# EAGLE design LED (EAGLE 6.2)
AUTHER: Karsten Hinz
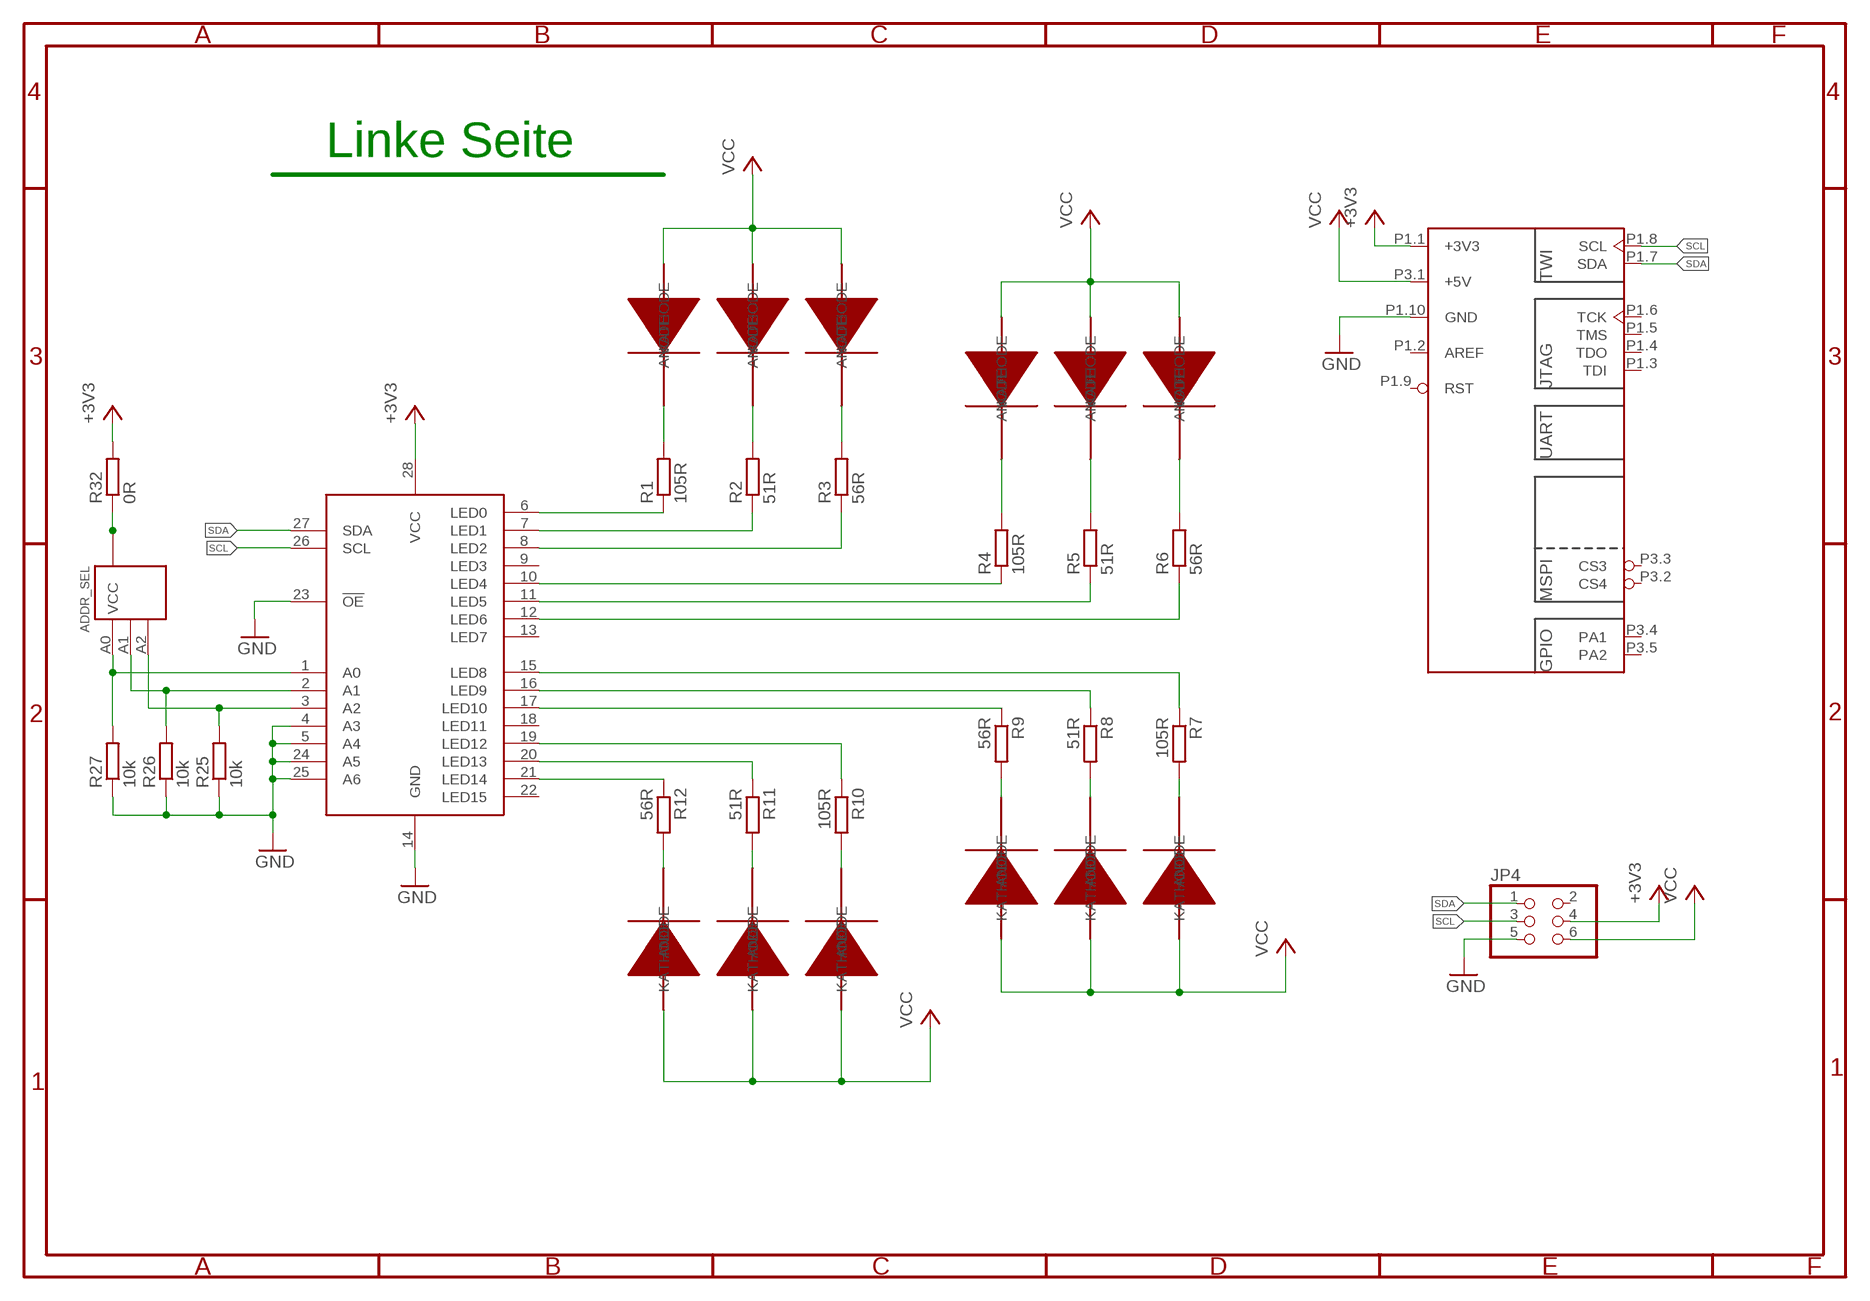
[diagram p0: schematic, sheet 1, part 1 of 2]
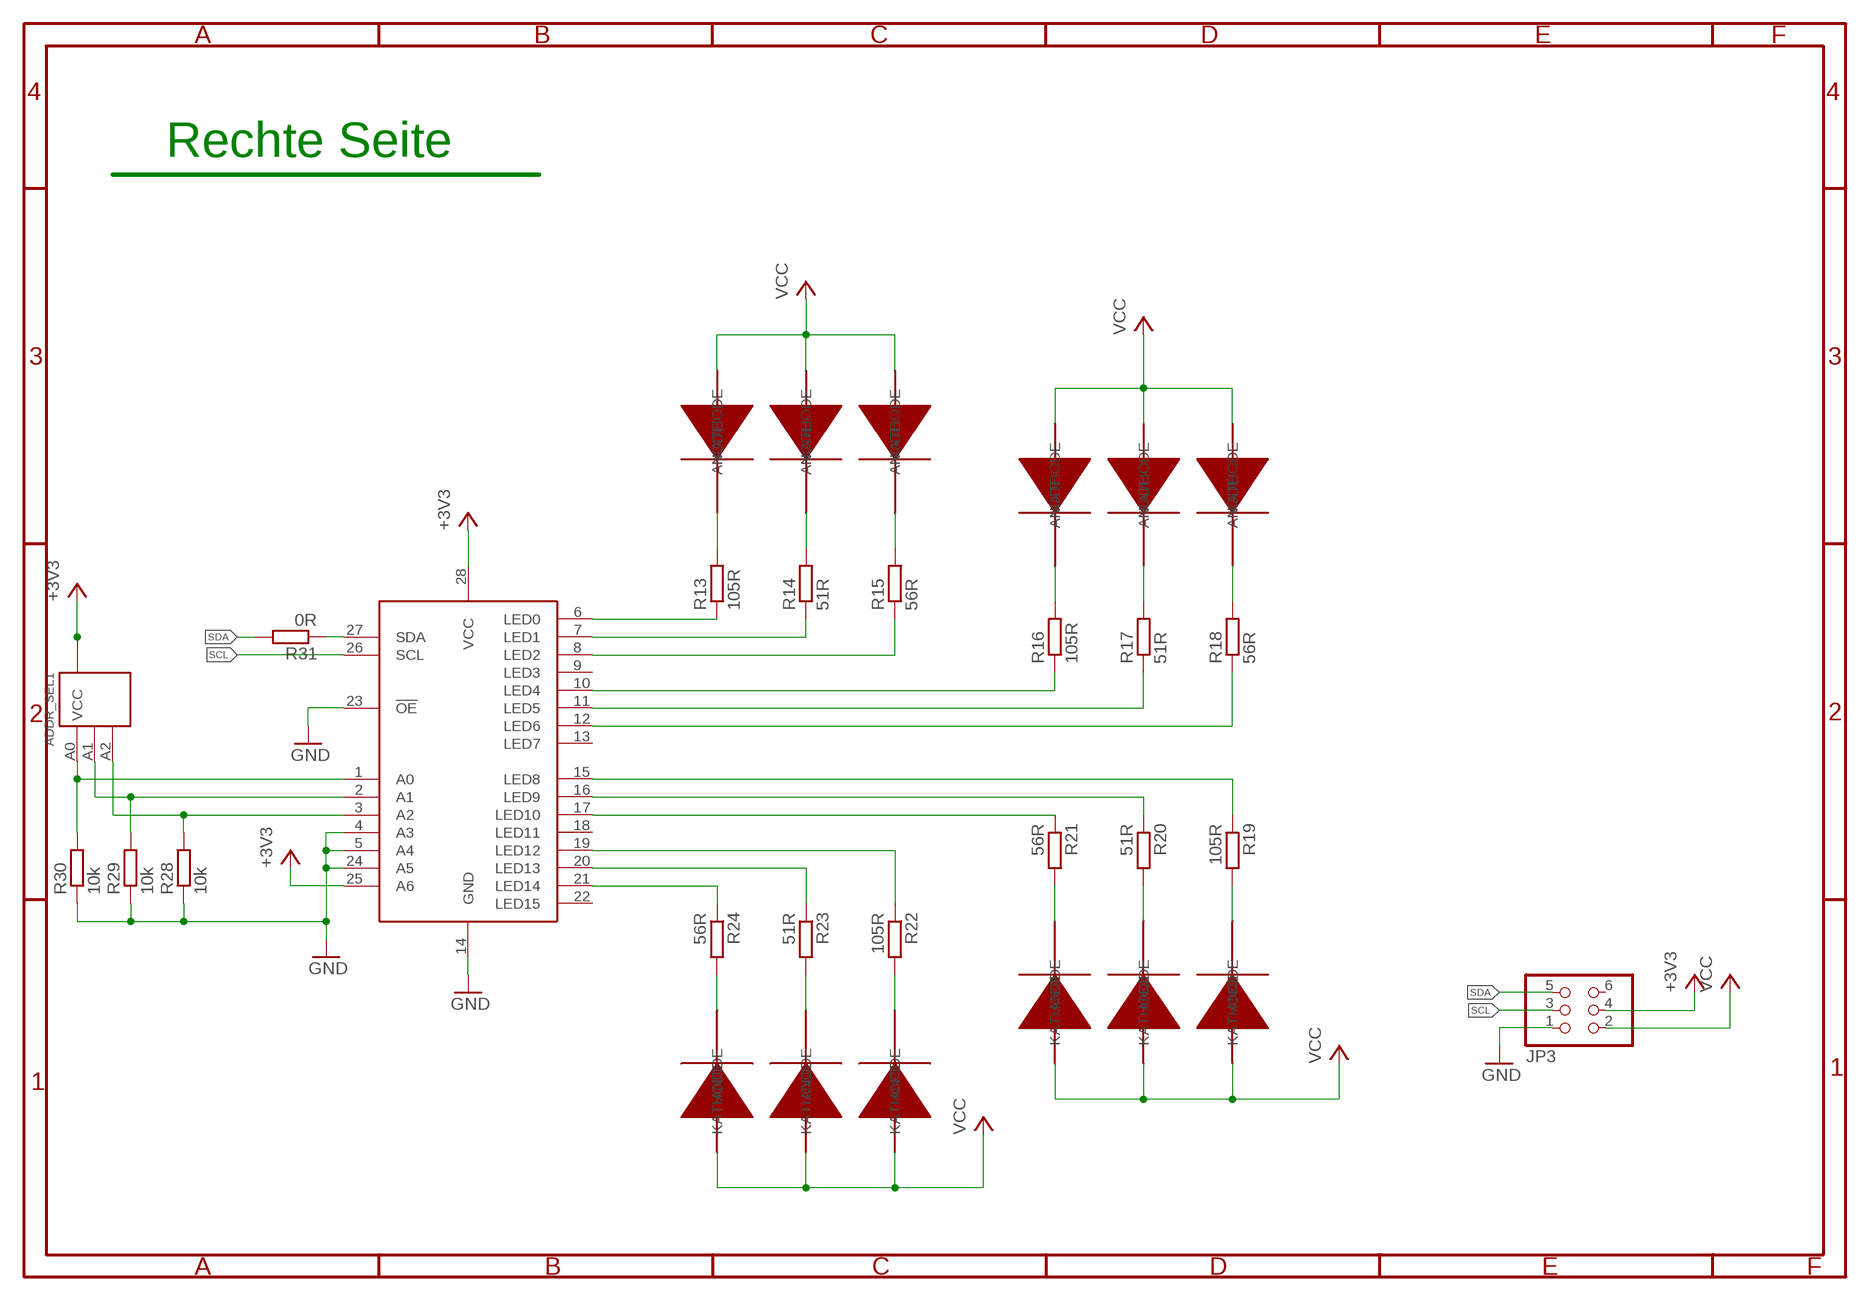
[diagram p1: schematic, sheet 1, part 2 of 2]

## Parts
ADDR_SEL  ADDR_SEL  [ADDR_SEL]
ADDR_SEL1  ADDR_SEL  [ADDR_SEL]
JP3  PINHD-2X3_2.54-90°  [2X03/90]
JP4  PINHD-2X3_2.54-90°  [2X03/90]
R1  105R  R-EU_R0603  [R0603]
R2  51R  R-EU_R0603  [R0603]
R3  56R  R-EU_R0603  [R0603]
R4  105R  R-EU_R0603  [R0603]
R5  51R  R-EU_R0603  [R0603]
R6  56R  R-EU_R0603  [R0603]
R7  105R  R-EU_R0603  [R0603]
R8  51R  R-EU_R0603  [R0603]
R9  56R  R-EU_R0603  [R0603]
R10  105R  R-EU_R0603  [R0603]
R11  51R  R-EU_R0603  [R0603]
R12  56R  R-EU_R0603  [R0603]
R13  105R  R-EU_R0603  [R0603]
R14  51R  R-EU_R0603  [R0603]
R15  56R  R-EU_R0603  [R0603]
R16  105R  R-EU_R0603  [R0603]
R17  51R  R-EU_R0603  [R0603]
R18  56R  R-EU_R0603  [R0603]
R19  105R  R-EU_R0603  [R0603]
R20  51R  R-EU_R0603  [R0603]
R21  56R  R-EU_R0603  [R0603]
R22  105R  R-EU_R0603  [R0603]
R23  51R  R-EU_R0603  [R0603]
R24  56R  R-EU_R0603  [R0603]
R25  10k  R-EU_R0402  [R0402]
R26  10k  R-EU_R0603  [R0603]
R27  10k  R-EU_R0402  [R0402]
R28  10k  R-EU_R0603  [R0603]
R29  10k  R-EU_R0603  [R0603]
R30  10k  R-EU_R0603  [R0603]
R31  0R  R-EU_R0603  [R0603]
R32  0R  R-EU_R0603  [R0603]
U$1  RGB-LED  [PLCC_SMD_LED_RGB]
U$2  RGB-LED  [PLCC_SMD_LED_RGB]
U$3  RGB-LED  [PLCC_SMD_LED_RGB]
U$4  RGB-LED  [PLCC_SMD_LED_RGB]
U$6  INGA_OHNE_JP2  [INGA_JP1_JP3]
U$9  PCA9635  [TSSOP28]
U$11  RGB-LED  [PLCC_SMD_LED_RGB]
U$12  RGB-LED  [PLCC_SMD_LED_RGB]
U$13  RGB-LED  [PLCC_SMD_LED_RGB]
U$14  RGB-LED  [PLCC_SMD_LED_RGB]
U$15  PCA9635  [TSSOP28]

## Nets
+3V3: JP3.4 JP4.4 R32.2 U$6.P1.1(+3V3) U$9.28(VCC) U$15.28(VCC)
BLA: ADDR_SEL.VCC ADDR_SEL.VCC@1(VCC) ADDR_SEL.VCC@2(VCC) R32.1
GND: JP3.1 JP4.5 R25.1 R26.1 R27.1 R28.1 R29.1 R30.1 U$6.P1.10(GND) U$9.4(A3) U$9.5(A4) U$9.14(GND) U$9.23(!OE) U$9.24(A5) U$9.25(A6) U$15.4(A3) U$15.5(A4) U$15.14(GND) U$15.23(!OE) U$15.24(A5)
N$1: R1.1 U$9.6(LED0)
N$2: R2.1 U$9.7(LED1)
N$3: R3.1 U$9.8(LED2)
N$4: R4.1 U$9.10(LED4)
N$5: R5.1 U$9.11(LED5)
N$6: R6.1 U$9.12(LED6)
N$7: R7.1 U$9.15(LED8)
N$8: R8.1 U$9.16(LED9)
N$9: R9.1 U$9.17(LED10)
N$10: R10.1 U$9.19(LED12)
N$11: R11.1 U$9.20(LED13)
N$12: R12.1 U$9.21(LED14)
N$13: R12.2 U$4.P1(BLUE:KATHODE)
N$14: R11.2 U$4.P2(GREEN:KATHODE)
N$15: R10.2 U$4.P3(RED:KATHODE)
N$17: R7.2 U$3.P3(RED:KATHODE)
N$18: R8.2 U$3.P2(GREEN:KATHODE)
N$19: R2.2 U$1.P2(GREEN:KATHODE)
N$20: R1.2 U$1.P3(RED:KATHODE)
N$21: R3.2 U$1.P1(BLUE:KATHODE)
N$22: R4.2 U$2.P3(RED:KATHODE)
N$23: R5.2 U$2.P2(GREEN:KATHODE)
N$24: R6.2 U$2.P1(BLUE:KATHODE)
N$25: R13.2 U$11.P3(RED:KATHODE)
N$26: R13.1 U$15.6(LED0)
N$27: R14.1 U$15.7(LED1)
N$28: R15.1 U$15.8(LED2)
N$29: R16.1 U$15.10(LED4)
N$30: R17.1 U$15.11(LED5)
N$31: R18.1 U$15.12(LED6)
N$32: R19.1 U$15.15(LED8)
N$33: R20.1 U$15.16(LED9)
N$34: R21.1 U$15.17(LED10)
N$35: R22.1 U$15.19(LED12)
N$36: R23.1 U$15.20(LED13)
N$37: R24.1 U$15.21(LED14)
N$38: R14.2 U$11.P2(GREEN:KATHODE)
N$39: R15.2 U$11.P1(BLUE:KATHODE)
N$40: R16.2 U$12.P3(RED:KATHODE)
N$41: R17.2 U$12.P2(GREEN:KATHODE)
N$42: R18.2 U$12.P1(BLUE:KATHODE)
N$43: R24.2 U$14.P1(BLUE:KATHODE)
N$44: R23.2 U$14.P2(GREEN:KATHODE)
N$45: R22.2 U$14.P3(RED:KATHODE)
N$46: R21.2 U$13.P1(BLUE:KATHODE)
N$47: R20.2 U$13.P2(GREEN:KATHODE)
N$48: R19.2 U$13.P3(RED:KATHODE)
N$49: R9.2 U$3.P1(BLUE:KATHODE)
N$51: ADDR_SEL.A2 R25.2 U$9.3(A2)
N$52: ADDR_SEL.A1 R26.2 U$9.2(A1)
N$53: ADDR_SEL.A0 R27.2 U$9.1(A0)
N$54: ADDR_SEL1.A2 R28.2 U$15.3(A2)
N$55: ADDR_SEL1.A1 R29.2 U$15.2(A1)
N$56: ADDR_SEL1.A0 R30.2 U$15.1(A0)
SCL: JP3.3 JP4.3 U$6.P1.8(SCL) U$9.26(SCL) U$15.26(SCL)
SDA: JP3.5 JP4.1 R31.2 U$6.P1.7(SDA) U$9.27(SDA)
SDA@1: R31.1 U$15.27(SDA)
VCC: ADDR_SEL1.VCC ADDR_SEL1.VCC@1(VCC) ADDR_SEL1.VCC@2(VCC) JP3.2 JP4.6 U$1.P4(RED:ANODE) U$1.P5(GREEN:ANODE) U$1.P6(BLUE:ANODE) U$2.P4(RED:ANODE) U$2.P5(GREEN:ANODE) U$2.P6(BLUE:ANODE) U$3.P4(RED:ANODE) U$3.P5(GREEN:ANODE) U$3.P6(BLUE:ANODE) U$4.P4(RED:ANODE) U$4.P5(GREEN:ANODE) U$4.P6(BLUE:ANODE) U$6.P3.1(+5V) U$11.P4(RED:ANODE) U$11.P5(GREEN:ANODE) U$11.P6(BLUE:ANODE) U$12.P4(RED:ANODE) U$12.P5(GREEN:ANODE) U$12.P6(BLUE:ANODE) U$13.P4(RED:ANODE) U$13.P5(GREEN:ANODE) U$13.P6(BLUE:ANODE) U$14.P4(RED:ANODE) U$14.P5(GREEN:ANODE) U$14.P6(BLUE:ANODE) U$15.25(A6) ; supply symbol labelled +3V3
Unconnected: JP3.6 JP4.2 U$6.P1.2(AREF) U$6.P1.3(TDI) U$6.P1.4(TDO) U$6.P1.5(TMS) U$6.P1.6(TCK) U$6.P1.9(RST) U$6.P3.2(CS4) U$6.P3.3(CS3) U$6.P3.4(PA1) U$6.P3.5(PA2) U$9.9(LED3) U$9.13(LED7) U$9.18(LED11) U$9.22(LED15) U$15.9(LED3) U$15.13(LED7) U$15.18(LED11) U$15.22(LED15)

## Notes on the sheet
- Linke Seite | Rechte Seite

## Library data of the parts
ADDR_SEL ADDR_SEL1 = inga:ADDR_SEL
JP3 JP4 = pinhead-1:PINHD-2X3: PIN HEADER
R1-R32 = rcl:R-EU_: RESISTOR, European symbol
U$1-U$4 U$11-U$14 = RGB-LED:RGB-LED: Descriptions: Impolux PLCC SMD LEDs offer high?intensity light output and a wide viewing angle and low power consumption in an standard package. Features: TOP LED Type Size?mm?:5.0*5.0*1.5 Emitting Color: Red, Pure Green, Blue Wide view angle at 120° SMT package Suitable for all SMT assembly and soldering method Pb?free Reflow soldering application RoHS Compliant Applications:
U$6 = inga:INGA_OHNE_JP2
U$9 U$15 = led_addon:PCA9635

## Board
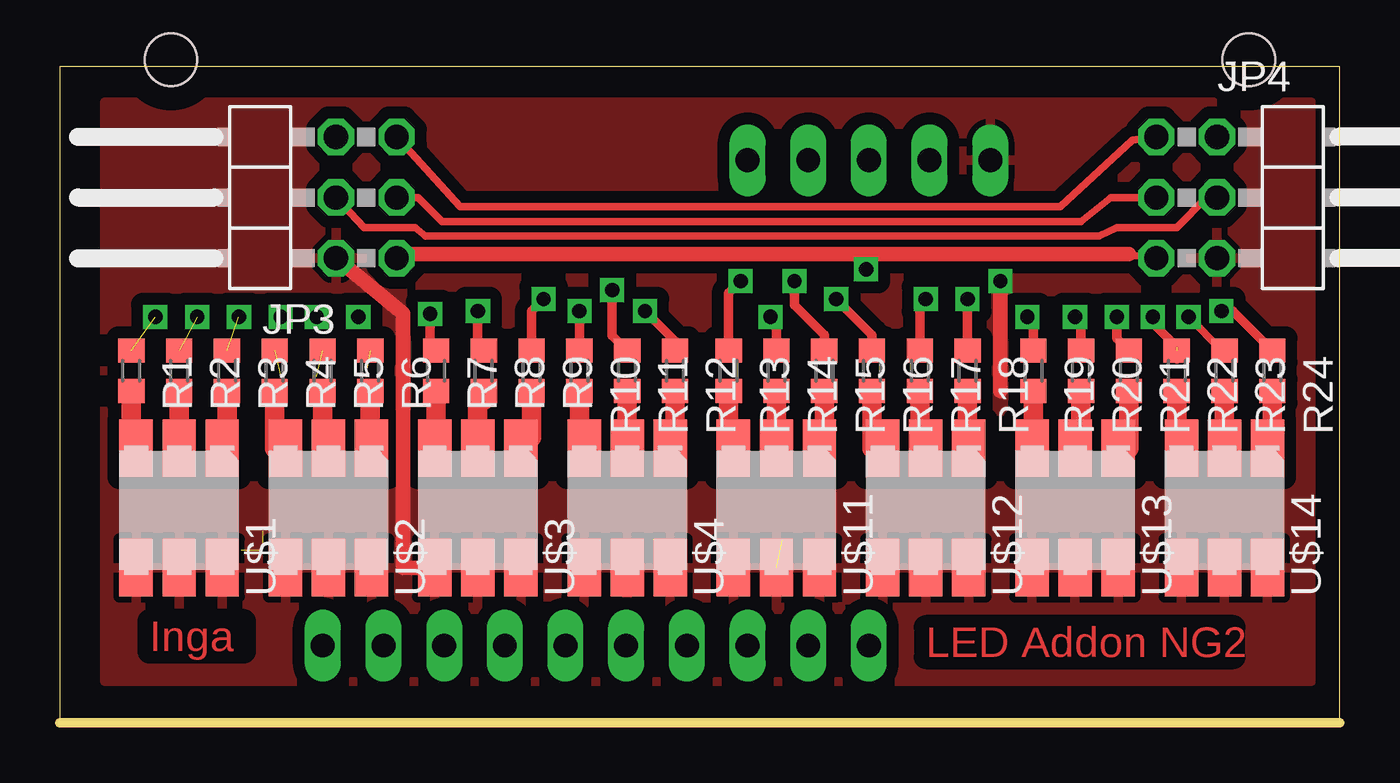
[diagram p2: board, top side]
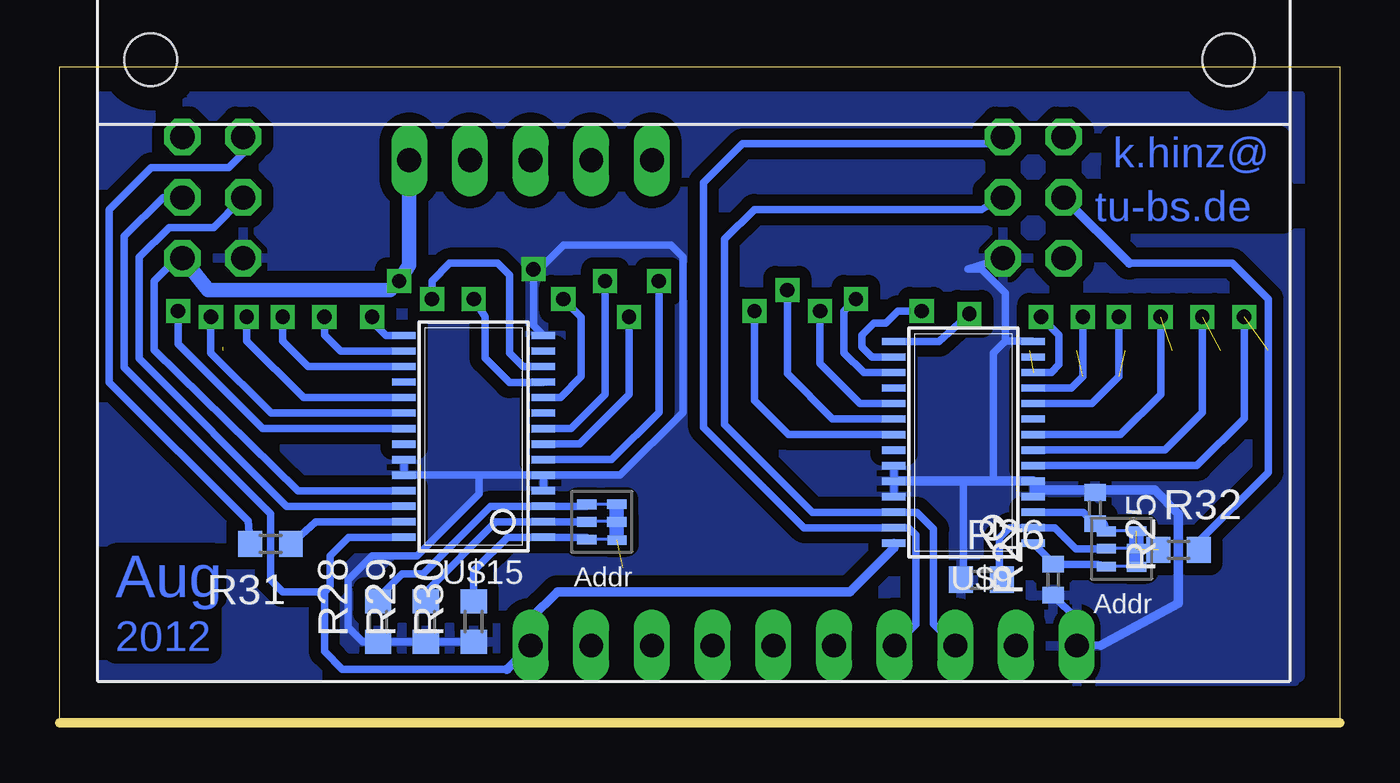
[diagram p3: board, bottom side, seen from below]

Size 53.58 x 27.48 mm. Coordinates in mm from the lower left corner, seen from the top.
Outline: 0,0 53.58,0 53.58,27.48 0,27.48 0,0
Copper layers (1*16): Top 0.035mm / dielectric 1.5mm / Bottom 0.035mm
Design rules: minimum track width 10mil, minimum drill 24mil, track to track 10mil, track to pad 10mil, pad to pad 10mil, via to via 10mil, smd to smd 0mil, copper to edge 40mil, drill to drill 8mil, minimum pad ring 10mil, minimum via ring 8mil, stop-mask expansion 4mil, vias tented up to drill 0mil, thermal gap 10mil

### Footprints (pad centres in the part's own frame; a part is rotated, then mirrored left to right if it is on the bottom)
ADDR_SEL = smd 0.813 x 0.406: A0 1.27,1.702; A1 1.27,0.953; A2 1.27,0.229; VCC 0,1.714; VCC@1 0.006,0.953; VCC@2 0.013,0.216
2X03/90 = drill 1.016 octagon: 1 -2.54,-6.35; 2 -2.54,-3.81; 3 0,-6.35; 4 0,-3.81; 5 2.54,-6.35; 6 2.54,-3.81
R0603 = smd 1 x 1.1: 1 -0.85,0; 2 0.85,0
R0402 = smd 0.7 x 0.9: 1 -0.65,0; 2 0.65,0
PLCC_SMD_LED_RGB = smd 2.4 x 1.4: P1 2.5,-1.8; P2 2.5,0; P3 2.5,1.8; P4 -2.5,1.8; P5 -2.5,0; P6 -2.5,-1.8
INGA_JP1_JP3 = drill 1 pad 1.47 long: P1.1 -7.62,-16.51; P1.2 -5.08,-16.51; P1.3 -2.54,-16.51; P1.4 0,-16.51; P1.5 2.54,-16.51; P1.6 5.08,-16.51; P1.7 7.62,-16.51; P1.8 10.16,-16.51; P1.9 12.7,-16.51; P1.10 15.24,-16.51; P3.1 -12.7,3.81; P3.2 -10.16,3.81; P3.3 -7.62,3.81; P3.4 -5.08,3.81; P3.5 -2.54,3.81 | hole 2.2: -23.52,8.02; 21.595,8.02
TSSOP28 = smd 0.305 x 0.991: 1 -4.225,-2.918; 2 -3.575,-2.918; 3 -2.925,-2.918; 4 -2.275,-2.918; 5 -1.625,-2.918; 6 -0.975,-2.918; 7 -0.325,-2.918; 8 0.325,-2.918; 9 0.975,-2.918; 10 1.625,-2.918; 11 2.275,-2.918; 12 2.925,-2.918; 13 3.575,-2.918; 14 4.225,-2.918; 15 4.225,2.918; 16 3.575,2.918; 17 2.925,2.918; 18 2.275,2.918; 19 1.625,2.918; 20 0.975,2.918; 21 0.325,2.918; 22 -0.325,2.918; 23 -0.975,2.918; 24 -1.625,2.918; 25 -2.275,2.918; 26 -2.925,2.918; 27 -3.575,2.918; 28 -4.225,2.918

### Placement (x,y rotation side)
ADDR_SEL  8.5,8.25 180 bottom
ADDR_SEL1  30.25,9.38 180 bottom
JP3  7.75,22 90 top
JP4  52.25,22 270 top
R1  3,14.75 270 top
R2  5,14.75 270 top
R3  7,14.75 270 top
R4  9,14.75 270 top
R5  11,14.75 270 top
R6  13,14.75 270 top
R7  15.75,14.75 270 top
R8  17.75,14.75 270 top
R9  19.75,14.75 270 top
R10  21.75,14.75 270 top
R11  23.75,14.75 270 top
R12  25.75,14.75 270 top
R13  28,14.75 270 top
R14  30,14.75 270 top
R15  32,14.75 270 top
R16  34,14.75 270 top
R17  36,14.75 270 top
R18  38,14.75 270 top
R19  40.75,14.75 270 top
R20  42.75,14.75 270 top
R21  44.75,14.75 270 top
R22  46.75,14.75 270 top
R23  48.75,14.75 270 top
R24  50.75,14.75 270 top
R25  10.25,9 270 bottom
R26  15,6 0 bottom
R27  12,6 90 bottom
R28  40.25,4.25 90 bottom
R29  38.25,4.25 90 bottom
R30  36.25,4.25 90 bottom
R31  44.75,7.5 180 bottom
R32  6.75,7.25 0 bottom
U$1  5,9 90 top
U$2  11.25,9 90 top
U$3  17.5,9 90 top
U$4  23.75,9 90 top
U$6  26.25,19.75 0 bottom
U$9  15.75,11.75 90 bottom
U$11  30,9 90 top
U$12  36.25,9 90 top
U$13  42.5,9 90 top
U$14  48.75,9 90 top
U$15  36.25,12 90 bottom

### Tracks (layer width: path | path; a pad name or v marks a point on that pad's centre or on a via)
+3V3
  Top 0.305: JP4.4 48,22 46.75,20.75 44.25,20.75 43.5,20.38 15.31,20.38 14.88,20.75 12.75,20.75 JP3.4
  Bottom 0.305: 34.88,2.25 41.75,2.25 42.5,3 42.5,5.5 | 42.5,5.5 44.25,5.5 44.75,6 44.75,8.75 50.88,14.88 50.88,20.38 49.25,22 JP4.4 | 42.5,5.5 42.25,5.75 42.25,7 41.48,7.78 U$15.28 | 8.81,19.25 4.5,19.25 3,17.75 3,10.5 5.95,7.55 5.95,7.3 R32.2
  Bottom 0.406: U$9.28 18.67,7.33 20.5,5.5 30.25,5.5 32.75,5.5 33.87,4.38 U$6.P1.1 34.86,2.25 34.88,2.25 | 8.81,19.25 JP3.4
BLA  (2 unrouted)
  Bottom 0.305: 8.45,7.25 ADDR_SEL.VCC@1
  Bottom 0.406: ADDR_SEL.VCC@1 ADDR_SEL.VCC
GND  (via drill 0.6)
  Top 0.305: JP4.5 44.79,19.59 44.75,19.62 | 14.27,19.62 JP3.1 | v33.75,19 33.75,19.62
  Top 0.61: 44.75,19.62 33.75,19.62 14.27,19.62
  Bottom 0.305: U$9.4 U$9.5 | R27.1 11.01,4.36 U$6.P1.10 10.99,3.26 9.99,3.26 | R26.1 15.75,6.1 15.75,10.12 | R25.1 10.35,9.75 10.75,9.75 | U$9.14 12.86,16 14,16 | 14,16 14.5,15.5 14.5,10.12 | R30.1 R29.1 R28.1 40.9,3.4 41.5,4 41.5,6 40.5,7 38.62,7 36.02,9.6 36.02,10.35 36,10.38 | U$15.4 U$15.5 | U$15.5 36,10.38 | 36,10.38 U$15.24 U$15.23 | U$9.25 U$9.24 U$9.23 | 33.75,18.75 32.5,20 28,20 27.5,19.5 27.5,13 30.12,10.38 U$15.5 | 33.75,18.75 33.75,16.64 U$15.14 | 33.75,18.75 v33.75,19 | 14,16 14,18 15,19 15.56,19 JP3.1
  Bottom 0.406: 9.99,3.26 6.75,5 6.75,8.75 7.75,9.75 10.75,9.75 12.71,9.75 U$9.5 14.5,10.12 15.75,10.12 U$9.24
  pour Bottom (isolate 0.5): 1.88,26 52.38,26 52.38,1.75 1.88,1.75
N$1  (via drill 0.6 pad 1.02)  (1 unrouted)
  Bottom 0.305: U$9.6 5.97,10.78 4,12.75 v4,17
N$2  (via drill 0.6 pad 1.02)  (1 unrouted)
  Bottom 0.305: U$9.7 7.33,11.43 5.75,13 v5.75,17
N$3  (via drill 0.6)  (1 unrouted)
  Bottom 0.305: U$9.8 9.18,12.07 7.5,13.75 v7.5,17
N$4  (via drill 0.6)  (1 unrouted)
  Bottom 0.305: U$9.10 10.38,13.38 9.25,14.5 v9.25,17
N$5  (via drill 0.6)  (1 unrouted)
  Bottom 0.305: U$9.11 11.22,14.03 10.75,14.5 v10.75,17
N$6  (via drill 0.6)  (1 unrouted)
  Bottom 0.305: U$9.12 12.07,14.68 11.75,15 11.75,16.25 v12.5,17
N$7  (via drill 0.6)
  Top 0.305: 15.5,16.75 v15.5,17.12
  Top 0.406: R7.1 15.5,15.85 v15.5,17.12
  Bottom 0.305: v15.5,17.12 16.77,15.97 U$9.15
N$8  (via drill 0.6)
  Top 0.406: R8.1 17.5,15.85 v17.5,17.25
  Bottom 0.305: v17.5,17.25 18.5,17.25 19,16.75 19.5,16.75 20,16.25 20,15.75 19.57,15.32 U$9.16
N$9  (via drill 0.6)
  Top 0.406: R9.1 19.75,17.25 v20.25,17.75
  Bottom 0.305: v20.25,17.75 20.75,17.25 20.75,15.5 19.93,14.68 U$9.17
N$10  (via drill 0.6)
  Top 0.305: 21.95,17.2 v21.75,17.25
  Top 0.406: R10.1 v21.75,17.25
  Bottom 0.305: U$9.19 20.07,13.38 21.75,15.05 v21.75,17.25
N$11  (via drill 0.6)
  Top 0.406: R11.1 23.12,16.23 v23.12,18.12
  Bottom 0.305: v23.12,18.12 23.12,14.62 21.23,12.72 U$9.20
N$12  (via drill 0.6)
  Top 0.406: R12.1 25.75,16 v24.5,17.25
  Bottom 0.305: v24.5,17.25 24.5,13.5 23.07,12.07 U$9.21
N$13
  Top 0.813: U$4.P1 25.75,11.5 R12.2
N$14
  Top 0.813: U$4.P2 R11.2
N$15
  Top 0.813: U$4.P3 21.75,11.5 R10.2
N$16
  pour Top (isolate 0.5): 1.88,26 1.88,1.75 52.25,1.75 52.38,26
N$17
  Top 0.813: U$3.P3 15.75,11.5 R7.2
N$18
  Top 0.813: R8.2 17.75,13.5 17.5,13.5 U$3.P2
N$19
  Top 0.813: U$1.P2 R2.2
N$20
  Top 0.813: U$1.P3 3,11.5 R1.2
N$21
  Top 0.813: U$1.P1 7,11.5 R3.2
N$22
  Top 0.813: U$2.P3 9,11.5 R4.2
N$23
  Top 0.813: U$2.P2 11,11.5 R5.2
N$24
  Top 0.813: U$2.P1 13,11.5 R6.2
N$25
  Top 0.813: U$11.P3 28,11.5 R13.2
N$26  (via drill 0.6)
  Top 0.406: R13.1 28,18 v28.5,18.5
  Bottom 0.305: v28.5,18.5 28.5,13 30.48,11.03 U$15.6
N$27  (via drill 0.6)
  Top 0.406: R14.1 30,16.75 v29.75,17
  Bottom 0.305: v29.75,17 29.75,13.75 31.82,11.68 U$15.7
N$28  (via drill 0.6)
  Top 0.406: R15.1 32,16.25 30.75,17.5 v30.75,18.5
  Bottom 0.305: U$15.8 32.17,12.32 30.75,13.75 v30.75,18.5
N$29  (via drill 0.6)
  Top 0.406: R16.1 34,16.25 v32.5,17.75
  Bottom 0.305: v32.5,17.75 31.75,17 31.75,14.5 32.62,13.62 U$15.10
N$30  (via drill 0.6)
  Top 0.406: R17.1 36,17.5 v36.25,17.75
  Bottom 0.305: v36.25,17.75 35.77,17.02 35.77,15.28 34.75,14.25 33.36,14.25 U$15.11
N$31  (via drill 0.6)
  Top 0.305: 38.05,17.7 v38,17.75
  Top 0.406: R18.1 v38,17.75
  Bottom 0.305: v38,17.75 38,18.5 37.25,19.25 35.25,19.25 34.75,18.75 34.75,15.5 34.17,14.93 U$15.12
N$32  (via drill 0.6)
  Top 0.305: 40.7,16.8 v40.5,17
  Top 0.406: R19.1 40.75,16.75 v40.5,17
  Bottom 0.305: v40.5,17 40.25,16.56 39.92,16.23 U$15.15
N$33  (via drill 0.6)
  Top 0.406: R20.1 42.75,16.75 v42.5,17
  Bottom 0.305: v42.5,17 42.5,16.25 41.83,15.57 U$15.16
N$34  (via drill 0.6)
  Top 0.406: R21.1 44.25,16.1 v44.25,17
  Bottom 0.305: v44.25,17 44.25,16 43.17,14.93 U$15.17
N$35  (via drill 0.6)  (1 unrouted)
  Top 0.305: 46.75,15.2 46.75,15.75
  Top 0.406: 46.75,15.75 45.75,16.75 v45.75,17
  Bottom 0.305: v45.75,17 45.75,16 43.38,13.62 U$15.19
N$36  (via drill 0.6)
  Top 0.305: 48.65,15.6 v47.25,17
  Top 0.406: R23.1 48.65,15.6
  Bottom 0.305: v47.25,17 47.25,15.5 44.73,12.97 U$15.20
N$37  (via drill 0.6)
  Top 0.406: R24.1 49.1,17.25 v48.62,17.25
  Bottom 0.305: v48.62,17.25 48.62,15.88 45.08,12.32 U$15.21
N$38
  Top 0.813: U$11.P2 R14.2
N$39
  Top 0.813: U$11.P1 32,11.5 R15.2
N$40
  Top 0.813: U$12.P3 34,11.5 R16.2
N$41
  Top 0.813: U$12.P2 36,11.5 R17.2
N$42
  Top 0.813: U$12.P1 38,11.5 R18.2
N$43
  Top 0.813: U$14.P1 50.75,11.5 R24.2
N$44
  Top 0.813: U$14.P2 R23.2
N$45
  Top 0.813: U$14.P3 46.75,11.5 R22.2
N$46
  Top 0.813: U$13.P1 44.75,11.5 R21.2
N$47
  Top 0.813: U$13.P2 42.75,11.5 R20.2
N$48
  Top 0.813: U$13.P3 40.75,11.5 R19.2
N$49
  Top 0.813: U$3.P1 19.75,11.95 R9.2
N$50
  pour Bottom (isolate 0.5): 1.75,26.25 51.75,26.25 51.75,2 1.75,2
N$51
  Bottom 0.305: U$9.3 10.72,8.82 R25.2 9.87,8.35 ADDR_SEL.A2
N$52
  Bottom 0.305: ADDR_SEL.A1 11.05,7.3 11.93,8.18 U$9.2 13.82,8.18 14.25,7.75 14.25,6.1 R26.2
N$53
  Bottom 0.305: U$9.1 12,6.69 R27.2 10.15,6.65 9.85,6.59 ADDR_SEL.A0
N$54
  Bottom 0.305: R28.2 40.4,5.1 | 40.4,5.1 40.5,5 | 40.4,5.1 39.25,6.25 38.38,6.25 35.55,9.07 U$15.3 31.52,9.07 ADDR_SEL1.A2
N$55
  Bottom 0.305: R29.2 38.25,5.5 35.33,8.43 U$15.2 ADDR_SEL1.A1
N$56
  Bottom 0.305: R30.2 36.25,6.38 36.12,6.5 34.83,7.78 U$15.1 31.52,7.78 ADDR_SEL1.A0
SCL
  Top 0.305: JP4.3 44,22 42.75,21 16,21 15,22 JP3.3
  Bottom 0.305: U$15.26 44.08,9.07 50.25,15.25 50.25,19.5 49,20.75 47.13,20.75 46.01,21.89 JP4.3 | JP3.3 15,21.5 24.5,21.5 25.75,20.25 25.75,12.5 22.07,8.82 U$9.26 17.7,8.82 17,8.12 17,4.15 U$6.P1.8
SDA
  Top 0.305: JP3.5 16.77,21.62 41.88,21.62 44.9,24.4 JP4.1
  Bottom 0.305: JP3.5 14.56,24.25 25,24.25 26.62,22.62 26.62,12.38 22.43,8.18 U$9.27 18.05,8.18 17.75,7.88 17.75,4.12 U$6.P1.7 | R31.2 45.7,8.45 51.5,14.25 51.5,21.5 49.75,23.25 46.5,23.25 45.9,23.85 JP4.1
SDA@1
  Bottom 0.305: U$15.27 42.88,8.43 R31.1
VCC  (via drill 0.6)  (1 unrouted)
  Top 0.61: v39.38,18.5 39.38,13.9 | JP3.2 14.38,17.14 14.38,6.5 U$3.P4
  Bottom 0.305: U$15.25 43.6,9.72 49.62,15.62 49.62,18.5 48.66,19.46 JP4.6 | ADDR_SEL1.VCC@1 ADDR_SEL1.VCC@2
  Bottom 0.406: v39.38,18.5 39.75,18.12 | ADDR_SEL1.VCC@1 ADDR_SEL1.VCC
  Bottom 0.61: 39.75,18.12 47.35,18.12 JP4.6 | v39.38,18.5 38.95,19.18 U$6.P3.1
  pour Top (isolate 0.5): 1.88,26 1.88,1.75 52.38,1.75 52.38,26

### Text on the board
Top: Inga | LED Addon NG2
Bottom: k.hinz@ | tu-bs.de | Aug | 2012